# Altium schematic sheet Music Box Shield.SchDoc
size A4; SheetNumber: 1; SheetTotal: 1
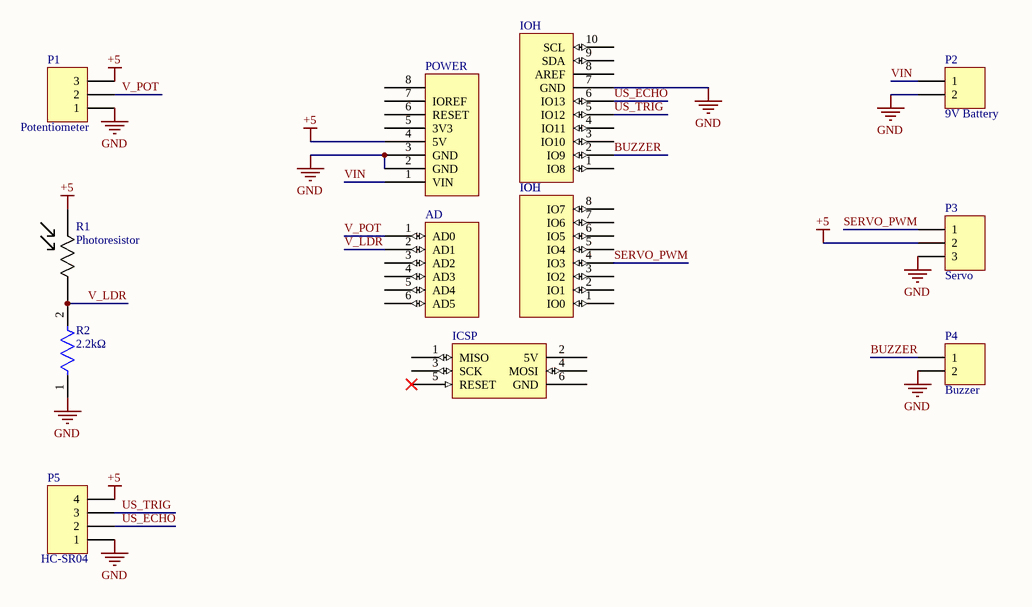
[diagram p0: Music Box Shield.SchDoc]

## Parts
AD  AD  [Header 6x1 8.5mm]  (value not drawn)
ICSP  ICSP  [ICSP]  (value not drawn)
IOH  IOH  [Header 10x1 8.5mm]
IOL  IOL  [Header 8x1 8.5mm]  (value not drawn)
P1  Potentiometer  [HDR1X3]
P2  9V Battery  [HDR1X2]
P3  Servo  [HDR1X3]
P4  Buzzer  [HDR1X2]
P5  HC-SR04  [HDR1X4]
POWER  POWER_UNO  [Header 8x1 8.5mm]  (value not drawn)
R1  Photoresistor  [5mm Photoresistor]
R2  Resistance: 2.2kΩ  [FP-CF18-MFG]  (hidden comment: CF18JT2K20)

## Nets
+5: P1.3 P3.2 P5.4 POWER.4(5V) R1.2
GND: IOH.7(GND) P1.1 P2.2 P3.3 P4.2 P5.1 POWER.2(GND) POWER.3(GND) R2.1
BUZZER: IOH.2(IO9) P4.1
SERVO_PWM: IOL.4(IO3) P3.1
US_ECHO: IOH.6(IO13) P5.2
US_TRIG: IOH.5(IO12) P5.3
V_LDR: AD.2(AD1) R1.1 R2.2
V_POT: AD.1(AD0) P1.2
VIN: P2.1 POWER.1(VIN)

Not connected (* = marked no-connect by the designer): AD 3(AD2) 4(AD3) 5(AD4) 6(AD5); ICSP 1(MISO) 2(5V) 3(SCK) 4(MOSI) 5(RESET)* 6(GND); IOH 1(IO8) 3(IO10) 4(IO11) 8(AREF) 9(SDA) 10(SCL); IOL 1(IO0) 2(IO1) 3(IO2) 5(IO4) 6(IO5) 7(IO6) 8(IO7); POWER 5(3V3) 6(RESET) 7(IOREF) 8

## Library data of the parts
P1 P3 = CMP-083-000090-3: Header, 3-Pin; Signal Integrity: Connector; LatestRevisionNote: Re-released for DXP Platform.; Source: Miscellaneous Connectors.SchLib; Design Item ID: Header 3; LatestRevisionDate: 17-Jul-2002; Publisher: Altium Limited; Component Type: Standard; Pin Count: 3
P2 P4 = CMP-083-000070-3: Header, 2-Pin; Signal Integrity: Connector; Design Item ID: Header 2; Pin Count: 2; Source: Miscellaneous Connectors.SchLib; LatestRevisionNote: Re-released for DXP Platform.; Component Type: Standard; LatestRevisionDate: 17-Jul-2002; Publisher: Altium Limited
P5 = CMP-083-000097-3: Header, 4-Pin; Signal Integrity: Connector; Publisher: Altium Limited; Design Item ID: Header 4; Source: Miscellaneous Connectors.SchLib; LatestRevisionNote: Re-released for DXP Platform.; LatestRevisionDate: 17-Jul-2002; Pin Count: 4; Component Type: Standard
R1 = Photoresistor: No Description Available
R2 = CMP-26528-000001-1: RES 2.2K OHM 1/8W 5% CF AXIAL; Manufacturer: Stackpole Electronics Inc; Description: RES 2.2K OHM 1/8W 5% AXIAL; Value: 2.2kΩ; Voltage Rating: 250V; Temperature Coefficient: 0/-400ppm/°C; Power Rating: 0.125W; Composition: Carbon Film; Octopart: https://octopart.com/cf18jt2k20-stackpole+electronics-19205714; Tolerance: 5%; Series: CF; Temperature Range Low: -55°C; ComponentLink2URL: https://www.seielect.com/catalog/sei-cf_cfm.pdf; Ipc Land Pattern Name: RESAD656W65L360D200; Package: CF18; Device Class L2: Resistors; Device Class L3: Through-Hole Resistors; Height: 2mm; Category: Res; ComponentLink2Description: Datasheet; Manufacturer Part Number: CF18JT2K20; Lead Free: Yes; Temperature Range High: +155°C; Temperature: -55°C to +155°C; RoHS: TRUE; Device Class L1: Passive Components; Digikey Description: RES 2.2K OHM 1/8W 5% CF AXIAL; Automotive: No